# EAGLE schematic Laser_Teensy_AudShield (EAGLE 9.6.2)

## Sheet 1 of 3
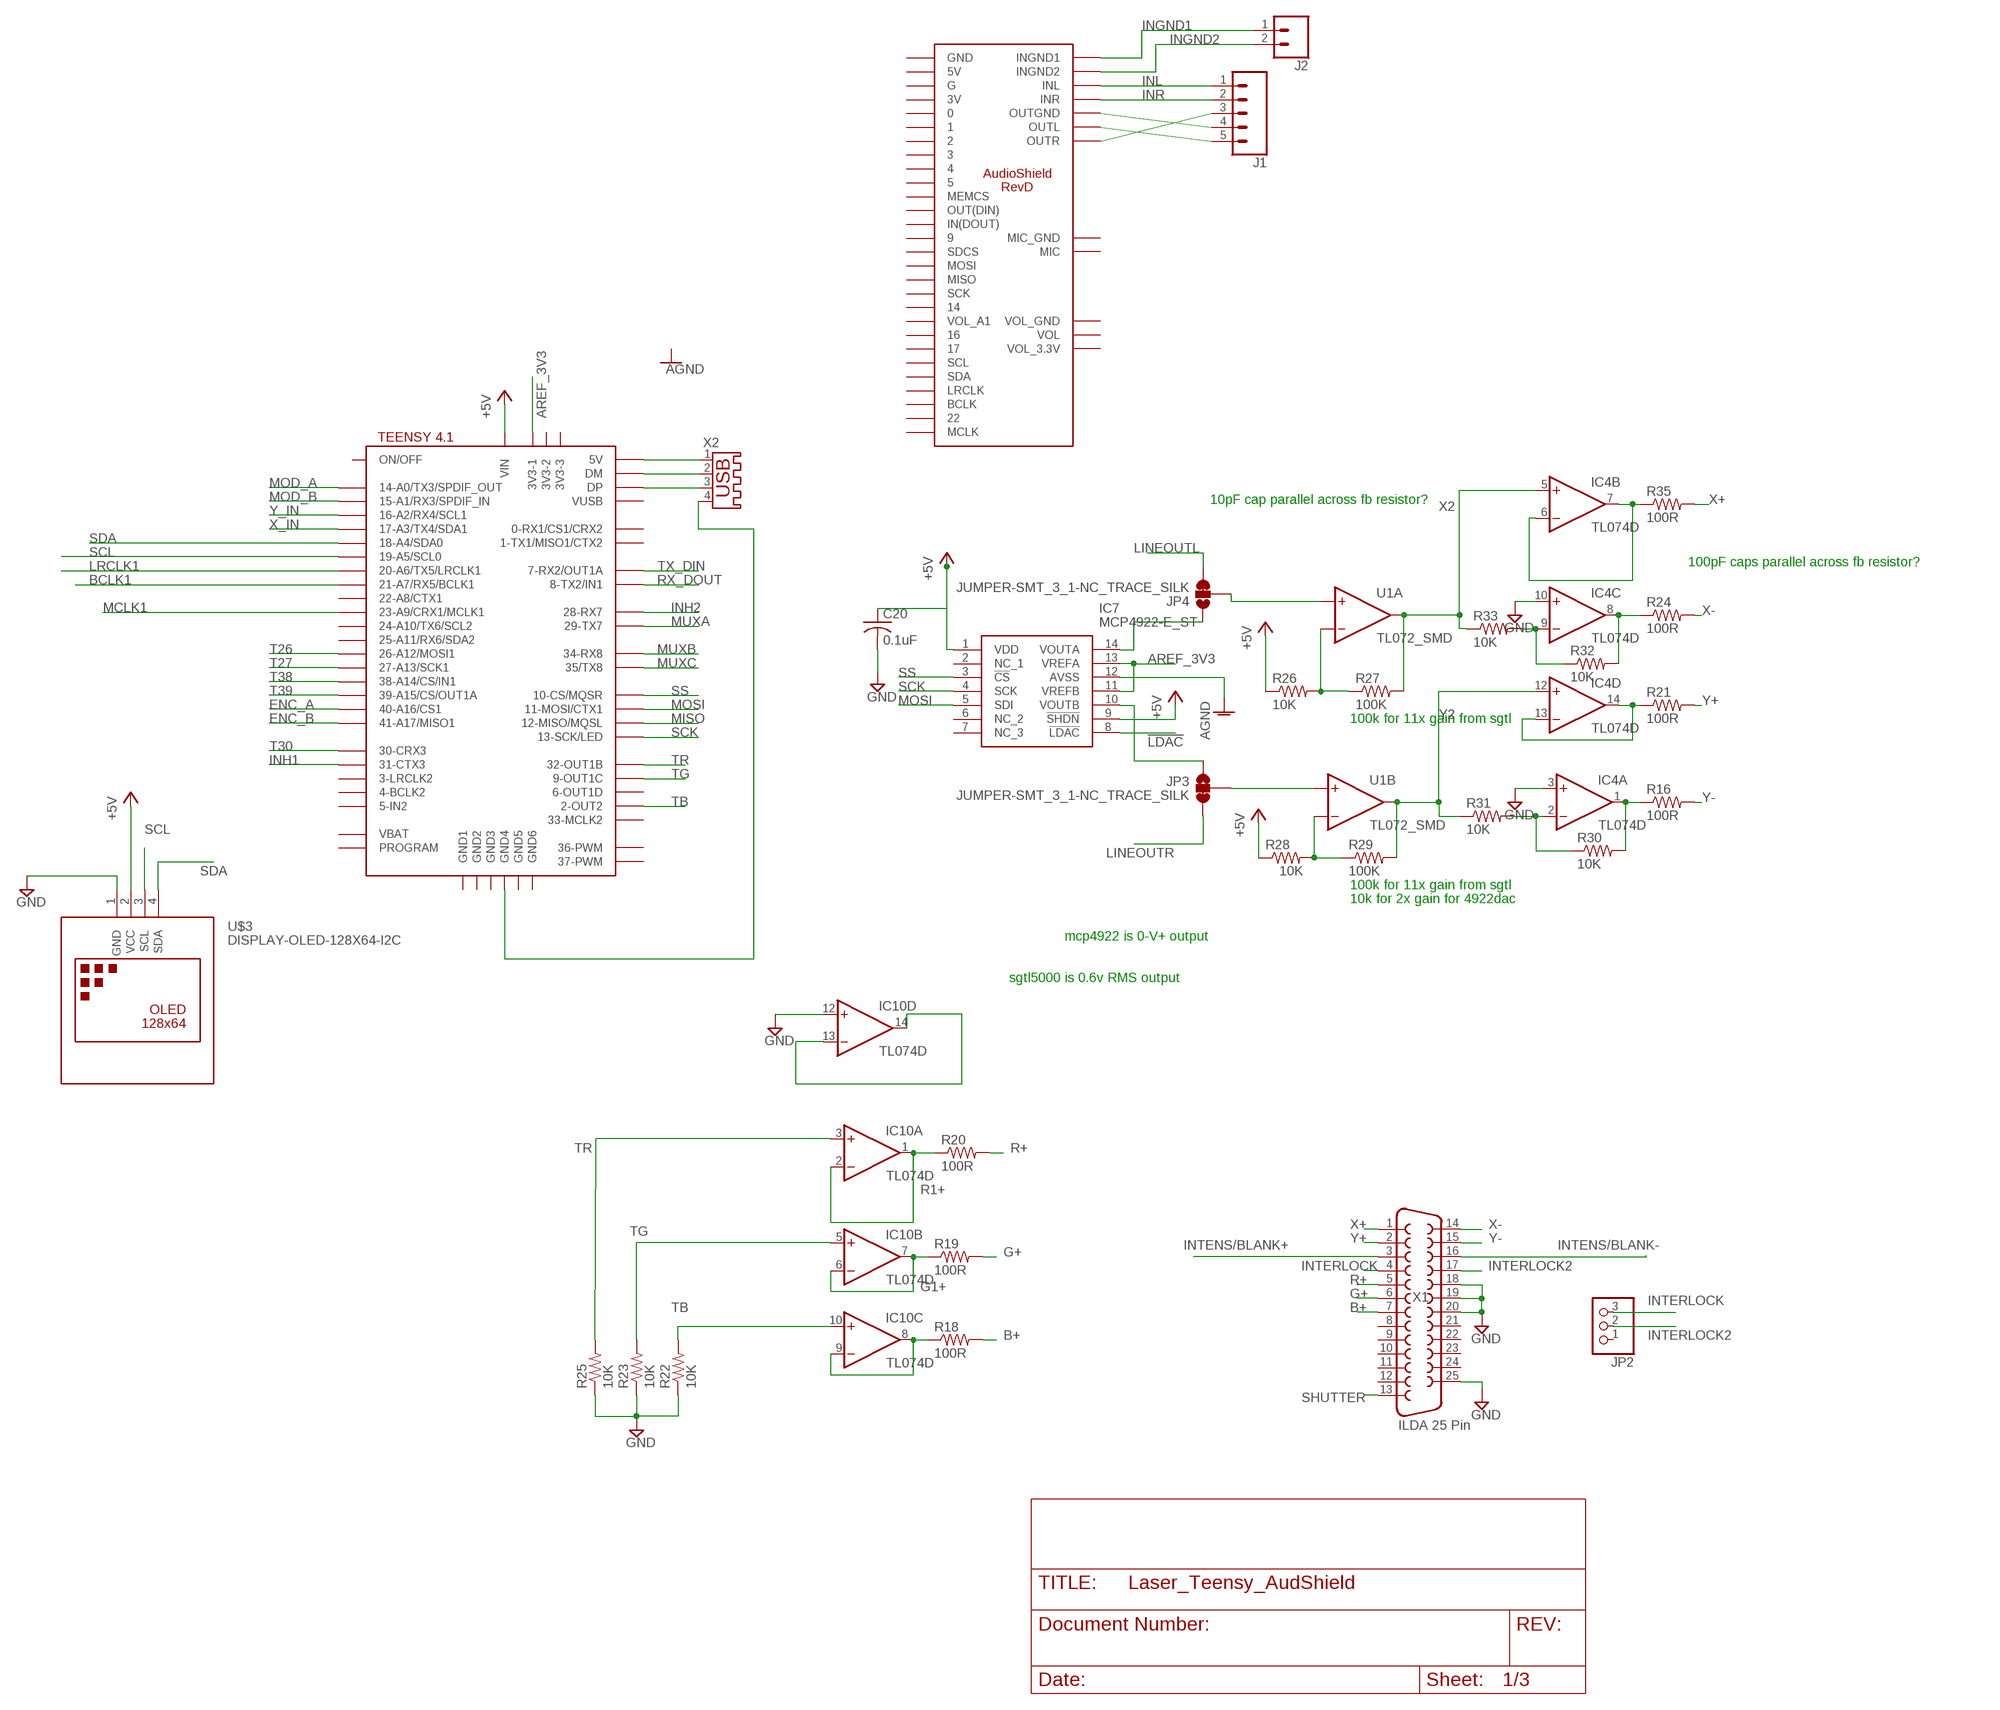
[diagram p0: schematic, sheet 1]

### Parts
C20  0.1uF  C-USC0603  [C0603]
IC4  TL074D  [SO14]
IC7  MCP4922-E_ST  [SOP65P638X110-14N]
IC10  TL074D  [SO14]
J1  CONN_05  [1X05]
J2  CONN_02  [1X02]
JP2  PINHD-1X3  [1X03]
JP3  JUMPER-SMT_3_1-NC_TRACE_SILK  [SMT-JUMPER_3_1-NC_TRACE_SILK]
JP4  JUMPER-SMT_3_1-NC_TRACE_SILK  [SMT-JUMPER_3_1-NC_TRACE_SILK]
R16  100R  R-US_R0603  [R0603]
R18  100R  R-US_R0603  [R0603]
R19  100R  R-US_R0603  [R0603]
R20  100R  R-US_R0603  [R0603]
R21  100R  R-US_R0603  [R0603]
R22  10K  R-US_R0603  [R0603]
R23  10K  R-US_R0603  [R0603]
R24  100R  R-US_R0603  [R0603]
R25  10K  R-US_R0603  [R0603]
R26  10K  R-US_R0603  [R0603]
R27  100K  R-US_R0603  [R0603]
R28  10K  R-US_R0603  [R0603]
R29  100K  R-US_R0603  [R0603]
R30  10K  R-US_R0603  [R0603]
R31  10K  R-US_R0603  [R0603]
R32  10K  R-US_R0603  [R0603]
R33  10K  R-US_R0603  [R0603]
R35  100R  R-US_R0603  [R0603]
U1  TL072_SMD  [SO08]
U$2  TEENSY41-E  [TENNSY41-E]
U$3  DISPLAY-OLED-128X64-I2C  [DISPLAY-OLED-128X64-I2C]
U$4  AUDIOSHIELD-REVD  [AUDIOSHIELD-REVD]
X1  ILDA 25 Pin  F25D  [F25D]
X2  USB-A003  [USB-A003]

### Nets
!LDAC: IC7.8(!LDAC)
+5V [power]: C20.1 IC7.1(VDD) IC7.9(!SHDN) R26.1 R28.1 U$2.VIN U$3.2(VCC) ; also sheet 3
AGND: IC7.12(AVSS)
AREF_3V3: IC7.11(VREFB) IC7.13(VREFA) U$2.3V3-1
B1+1: IC10.8(C:OUT) IC10.9(C:-IN) R18.1
B+: R18.2 X1.7
BCLK1: U$2.21-A7/RX5/BCLK1
ENC_A: U$2.40-A16/CS1 ; also sheet 2
ENC_B: U$2.41-A17/MISO1 ; also sheet 2
G1+: IC10.6(B:-IN) IC10.7(B:OUT) R19.1
G+: R19.2 X1.6
GND: C20.2 IC4.3(A:+IN) IC4.10(C:+IN) IC10.12(D:+IN) R22.1 R23.1 R25.1 U$3.1(GND) X1.18 X1.19 X1.20 X1.25 ; also sheet 2,3
INGND1: J2.1 U$4.INGND1
INGND2: J2.2 U$4.INGND2
INH1: U$2.31-CTX3 ; also sheet 2
INH2: U$2.28-RX7 ; also sheet 2
INL: J1.1 U$4.INL
INR: J1.2 U$4.INR
INTENS/BLANK+: X1.3
INTENS/BLANK-: X1.16
INTERLOCK: JP2.3 X1.4
INTERLOCK2: JP2.2 X1.17
LINEOUTL: JP4.3
LINEOUTR: JP3.3
LRCLK1: U$2.20-A6/TX5/LRCLK1
MCLK1: U$2.23-A9/CRX1/MCLK1
MISO: U$2.12-MISO/MQSL
MOD_A: U$2.14-A0/TX3/SPDIF_OUT ; also sheet 2
MOD_B: U$2.15-A1/RX3/SPDIF_IN ; also sheet 2
MOSI: IC7.5(SDI) U$2.11-MOSI/CTX1
MUXA: U$2.29-TX7 ; also sheet 2
MUXB: U$2.34-RX8 ; also sheet 2
MUXC: U$2.35-TX8(35/TX8) ; also sheet 2
N$1: IC7.14(VOUTA) JP4.1
N$2: IC7.10(VOUTB) JP3.1
N$3: U$2.+5V(5V) X2.1
N$4: U$2.DM X2.2
N$5: U$2.DP X2.3
N$12: U$2.GND4 X2.4
N$13: IC10.13(D:-IN) IC10.14(D:OUT)
N$17: JP3.2 U1.5(B:+IN)
N$18: JP4.2 U1.3(A:+IN)
N$20: J1.4 U$4.OUTGND
N$30: R26.2 R27.1 U1.2(A:-IN)
N$31: R28.2 R29.1 U1.6(B:-IN)
N$35: IC4.9(C:-IN) R32.1 R33.2
N$36: IC4.2(A:-IN) R30.1 R31.2
N$57: J1.3 U$4.OUTR
N$59: J1.5 U$4.OUTL
R1+: IC10.1(A:OUT) IC10.2(A:-IN) R20.1
R+: R20.2 X1.5
RX_DOUT: U$2.8-TX2/IN1
SCK: IC7.4(SCK) U$2.13-SCK/LED
SCL: U$2.19-A5/SCL0 U$3.3(SCL)
SDA: U$2.18-A4/SDA0 U$3.4(SDA)
SHUTTER: X1.13
SS: IC7.3(!CS) U$2.10-CS\MQSR(10-CS/MQSR)
T26: U$2.26-A12/MOSI1 ; also sheet 2
T27: U$2.27-A13/SCK1 ; also sheet 2
T30: U$2.30-CRX3
T38: U$2.38-A14/CS/IN1 ; also sheet 2
T39: U$2.39-A15/CS/OUT1A ; also sheet 2
TB: IC10.10(C:+IN) R22.2 U$2.2-OUT2
TG: IC10.5(B:+IN) R23.2 U$2.9-OUT1C
TR: IC10.3(A:+IN) R25.2 U$2.32-OUT1B
TX_DIN: U$2.7-RX2/OUT1A
X1+: IC4.6(B:-IN) IC4.7(B:OUT) R35.1
X1-: IC4.8(C:OUT) R24.1 R32.2
X2: IC4.5(B:+IN) R27.2 R33.1 U1.1(A:OUT)
X+: R35.2 X1.1
X-: R24.2 X1.14
X_IN: U$2.17-A3/TX4/SDA1 ; also sheet 2
Y1+: IC4.13(D:-IN) IC4.14(D:OUT) R21.1
Y1-: IC4.1(A:OUT) R16.1 R30.2
Y2: IC4.12(D:+IN) R29.2 R31.1 U1.7(B:OUT)
Y+: R21.2 X1.2
Y-: R16.2 X1.15
Y_IN: U$2.16-A2/RX4/SCL1 ; also sheet 2
Unconnected: IC7.2(NC_1) IC7.6(NC_2) IC7.7(NC_3) JP2.1 U$2.0-RX1/CS1/CRX2 U$2.1-TX1/MISO1/CTX2 U$2.3-LRCLK2 U$2.3V3-2 U$2.3V3-3 U$2.4-BCLK2 U$2.5-IN2 U$2.6-OUT1D U$2.22-A8/CTX1 U$2.24-A10/TX6/SCL2 U$2.25-A11/RX6/SDA2 U$2.33-MCLK2 U$2.36-PWM U$2.37-PWM U$2.GND1 U$2.GND2 U$2.GND3 U$2.GND5 U$2.GND6 U$2.ON/OFF U$2.PROGRAM U$2.VBAT U$2.VUSB U$4.0 U$4.1 U$4.2 U$4.3 U$4.3V U$4.4 U$4.5 U$4.5V U$4.6(MEMCS) U$4.7(OUT(DIN)) U$4.8(IN(DOUT)) U$4.9 U$4.10(SDCS) U$4.11(MOSI) U$4.12(MISO) U$4.13(SCK) U$4.14 U$4.15(VOL_A1) U$4.16 U$4.17 U$4.18(SDA) U$4.19(SCL) U$4.20(LRCLK) U$4.21(BCLK) U$4.22 U$4.23(MCLK) U$4.G U$4.GND U$4.GND_MIC(MIC_GND) U$4.MIC U$4.VOL U$4.VOL_3.3V U$4.VOL_GND X1.8 X1.9 X1.10 X1.11 X1.12 X1.21 X1.22 X1.23 X1.24

### Notes on the sheet
- 10pF cap parallel across fb resistor?
- 100pF caps parallel across fb resistor?
- 100k for 11x gain from sgtl
- 100k for 11x gain from sgtl
- 10k for 2x gain for 4922dac
- mcp4922 is 0-V+ output
- sgtl5000 is 0.6v RMS output

## Sheet 2 of 3
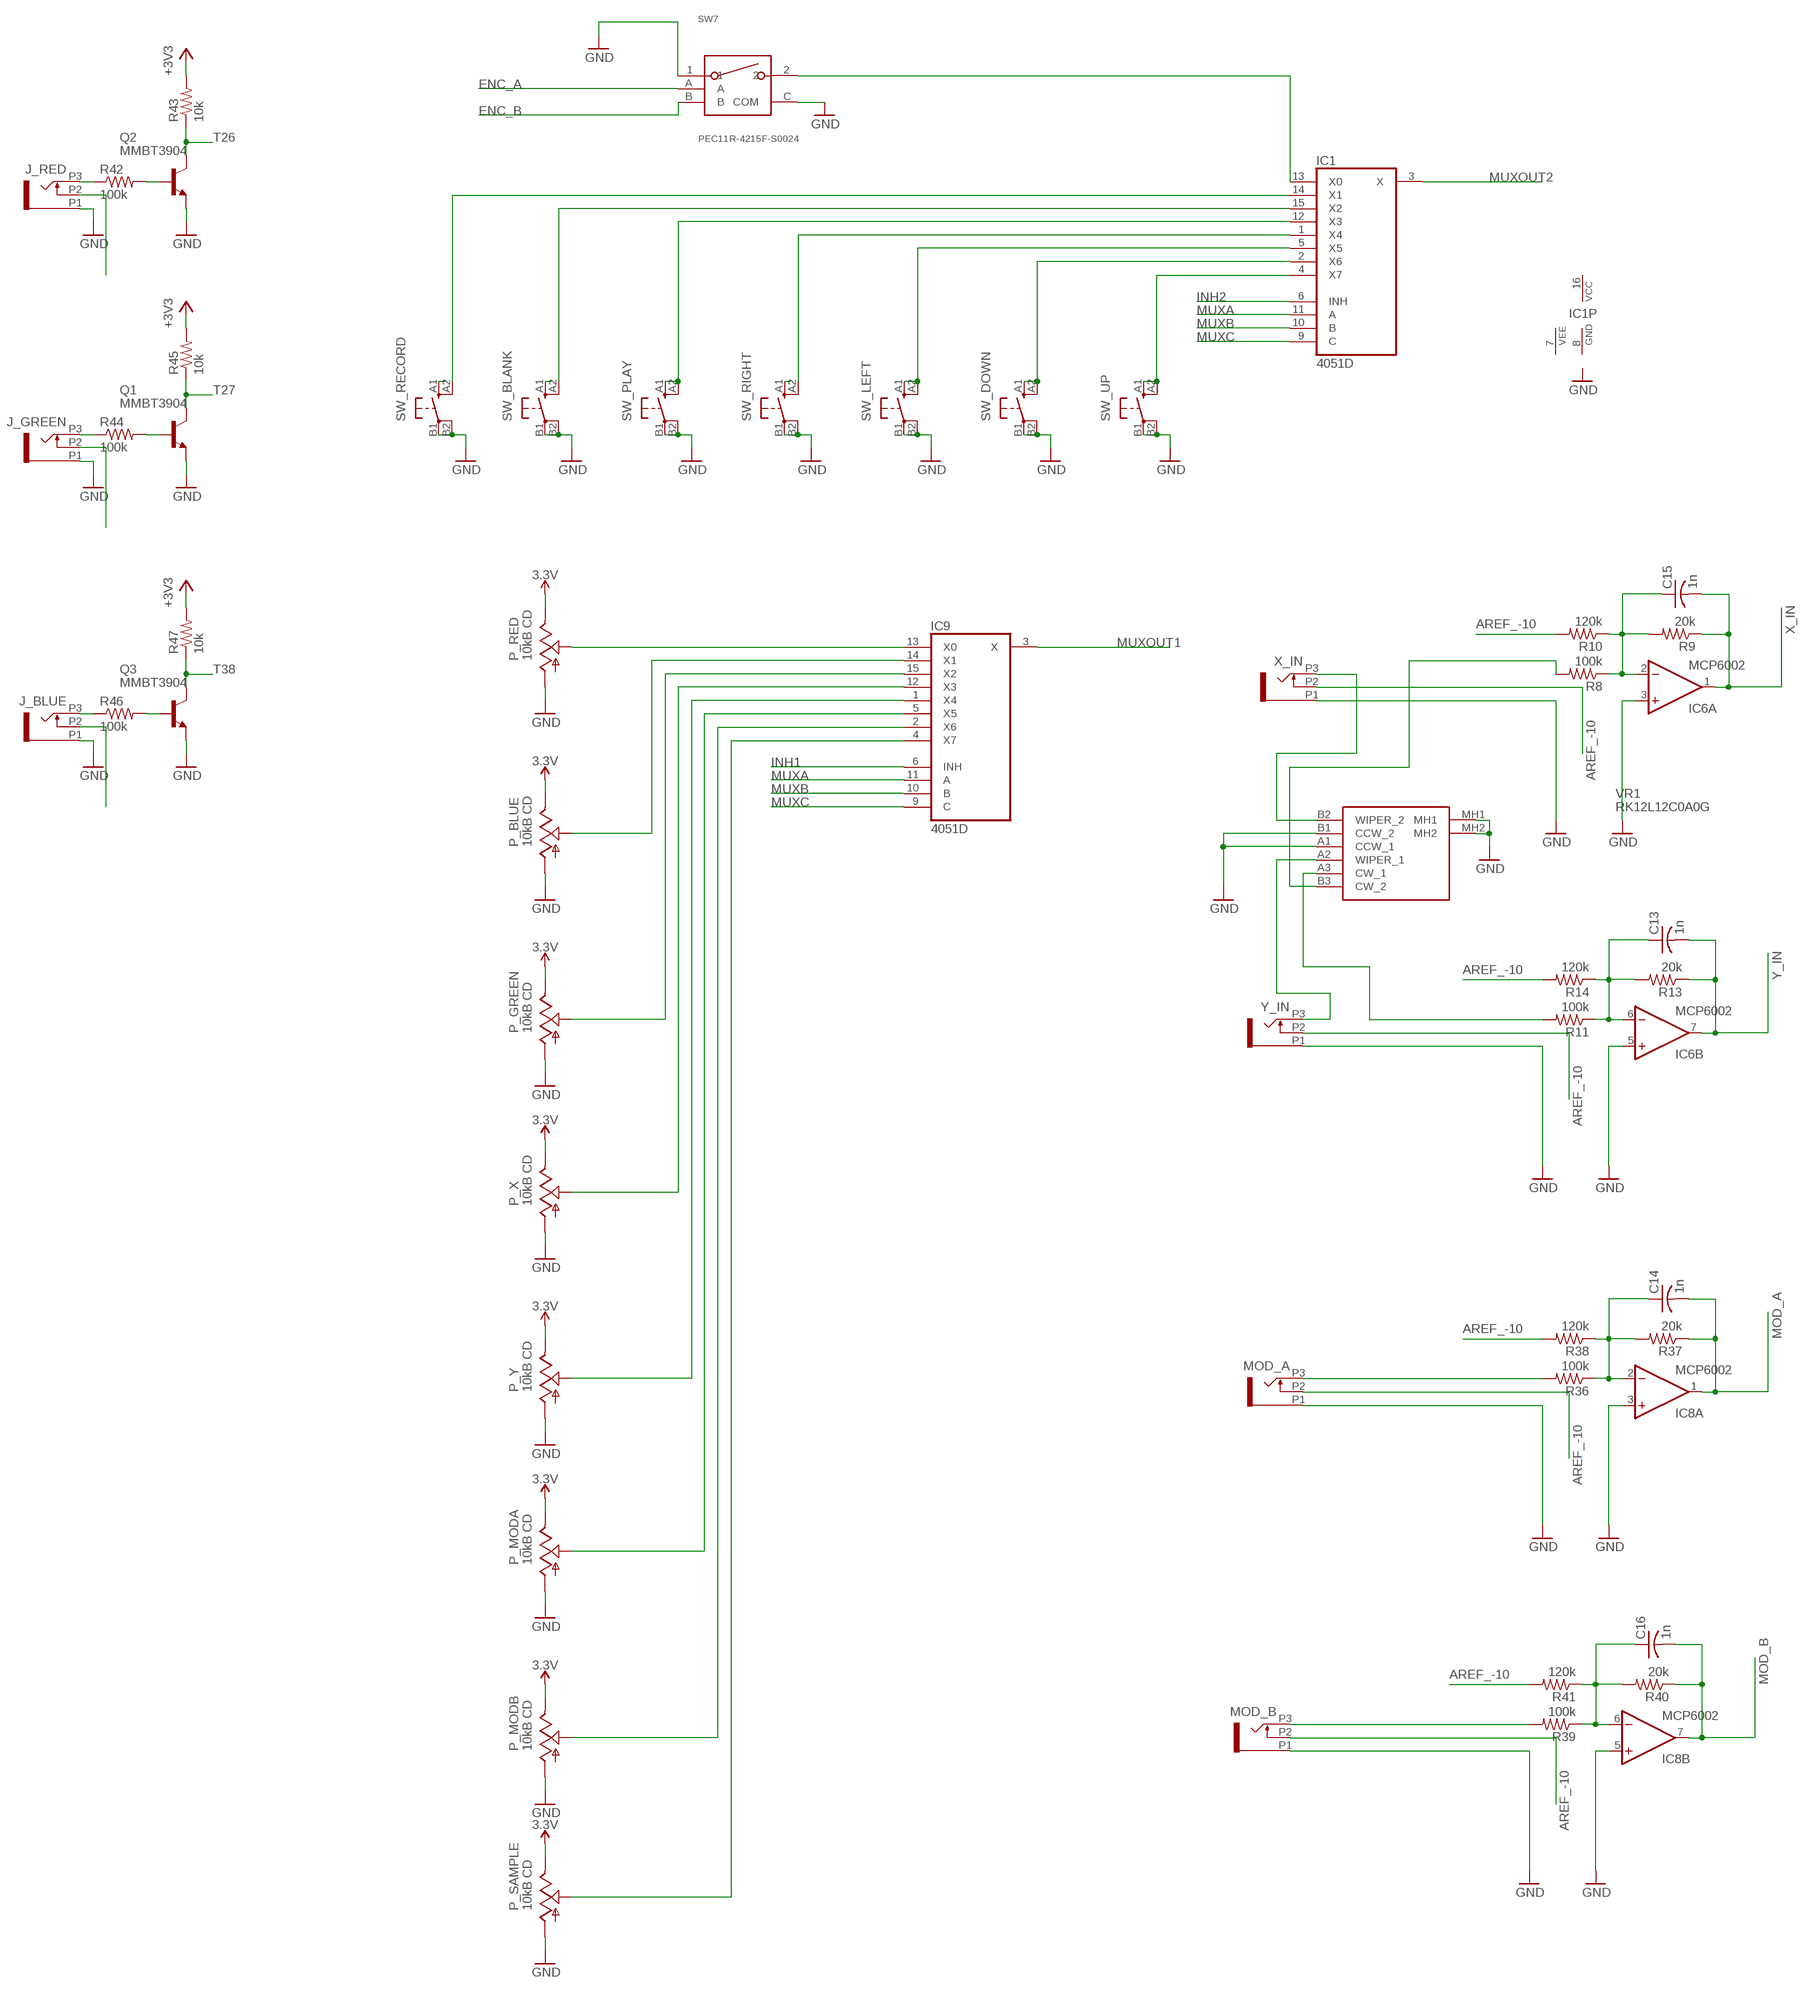
[diagram p1: schematic, sheet 2]

### Parts
C13  1n  C-US050-025X075  [C050-025X075]
C14  1n  C-US050-025X075  [C050-025X075]
C15  1n  C-US050-025X075  [C050-025X075]
C16  1n  C-US050-025X075  [C050-025X075]
IC1  4051D  [SO16]
IC6  MCP6002  TL072D  [SO08]
IC8  MCP6002  TL072D  [SO08]
IC9  4051D  [SO16]
J_BLUE  PJ301_THONKICONN6  [WQP_PJ_301M6]
J_GREEN  PJ301_THONKICONN6  [WQP_PJ_301M6]
J_RED  PJ301_THONKICONN6  [WQP_PJ_301M6]
MOD_A  PJ301_THONKICONN6  [WQP_PJ_301M6]
MOD_B  PJ301_THONKICONN6  [WQP_PJ_301M6]
P_BLUE  10kB CD  POT_USVERTICAL_PS  [ALPS_POT_VERTICAL_PS]
P_GREEN  10kB CD  POT_USVERTICAL_PS  [ALPS_POT_VERTICAL_PS]
P_MODA  10kB CD  POT_USVERTICAL_PS  [ALPS_POT_VERTICAL_PS]
P_MODB  10kB CD  POT_USVERTICAL_PS  [ALPS_POT_VERTICAL_PS]
P_RED  10kB CD  POT_USVERTICAL_PS  [ALPS_POT_VERTICAL_PS]
P_SAMPLE  10kB CD  POT_USVERTICAL_PS  [ALPS_POT_VERTICAL_PS]
P_X  10kB CD  POT_USVERTICAL_PS  [ALPS_POT_VERTICAL_PS]
P_Y  10kB CD  POT_USVERTICAL_PS  [ALPS_POT_VERTICAL_PS]
Q1  MMBT3904  MMBT3904LT1-NPN-SOT23-BEC  [SOT23-BEC]
Q2  MMBT3904  MMBT3904LT1-NPN-SOT23-BEC  [SOT23-BEC]
Q3  MMBT3904  MMBT3904LT1-NPN-SOT23-BEC  [SOT23-BEC]
R8  100k  R-US_0204/7  [0204/7]
R9  20k  R-US_0204/7  [0204/7]
R10  120k  R-US_0204/7  [0204/7]
R11  100k  R-US_0204/7  [0204/7]
R13  20k  R-US_0204/7  [0204/7]
R14  120k  R-US_0204/7  [0204/7]
R36  100k  R-US_0204/7  [0204/7]
R37  20k  R-US_0204/7  [0204/7]
R38  120k  R-US_0204/7  [0204/7]
R39  100k  R-US_0204/7  [0204/7]
R40  20k  R-US_0204/7  [0204/7]
R41  120k  R-US_0204/7  [0204/7]
R42  100k  R-US_R0603  [R0603]
R43  10k  R-US_R0603  [R0603]
R44  100k  R-US_R0603  [R0603]
R45  10k  R-US_R0603  [R0603]
R46  100k  R-US_R0603  [R0603]
R47  10k  R-US_R0603  [R0603]
SW7  PEC11R-4215F-S0024  [PEC11R-4215F-S0024]
SW_BLANK  D6R  [D6R]
SW_DOWN  D6R  [D6R]
SW_LEFT  D6R  [D6R]
SW_PLAY  D6R  [D6R]
SW_RECORD  D6R  [D6R]
SW_RIGHT  D6R  [D6R]
SW_UP  D6R  [D6R]
VR1  RK12L12C0A0G  [RK12L12C0A0G]
X_IN  PJ301_THONKICONN6  [WQP_PJ_301M6]
Y_IN  PJ301_THONKICONN6  [WQP_PJ_301M6]

### Nets
3.3V [+3V3]: P_BLUE.P$1(E) P_GREEN.P$1(E) P_MODA.P$1(E) P_MODB.P$1(E) P_RED.P$1(E) P_SAMPLE.P$1(E) P_X.P$1(E) P_Y.P$1(E)
+3V3: R43.2 R45.2 R47.2 ; also sheet 3
AREF_-10 [-10V]: MOD_A.P2 MOD_B.P2 R10.2 R14.2 R38.2 R41.2 X_IN.P2 Y_IN.P2 ; also sheet 3
ENC_A: SW7.A ; also sheet 1
ENC_B: SW7.B ; also sheet 1
GND: IC6.3(A:+IN) IC6.5(B:+IN) IC8.3(A:+IN) IC8.5(B:+IN) J_BLUE.P1 J_GREEN.P1 J_RED.P1 MOD_A.P1 MOD_B.P1 P_BLUE.P$3(A) P_GREEN.P$3(A) P_MODA.P$3(A) P_MODB.P$3(A) P_RED.P$3(A) P_SAMPLE.P$3(A) P_X.P$3(A) P_Y.P$3(A) Q1.E Q2.E Q3.E SW7.1 SW7.C(COM) SW_BLANK.B2(P1) SW_DOWN.B1(P) SW_DOWN.B2(P1) SW_LEFT.B1(P) SW_LEFT.B2(P1) SW_PLAY.B1(P) SW_PLAY.B2(P1) SW_RECORD.B2(P1) SW_RIGHT.B2(P1) SW_UP.B1(P) SW_UP.B2(P1) VR1.A1(CCW_1) VR1.B1(CCW_2) VR1.MH1 VR1.MH2 X_IN.P1 Y_IN.P1 ; also sheet 1,3
INH1: IC9.6(INH) ; also sheet 1
INH2: IC1.6(INH) ; also sheet 1
MOD_A: C14.2 IC8.1(A:OUT) R37.1 ; also sheet 1
MOD_B: C16.2 IC8.7(B:OUT) R40.1 ; also sheet 1
MUXA: IC1.11(A) IC9.11(A) ; also sheet 1
MUXB: IC1.10(B) IC9.10(B) ; also sheet 1
MUXC: IC1.9(C) IC9.9(C) ; also sheet 1
MUXOUT1: IC9.3(X)
MUXOUT2: IC1.3(X)
N$6: C15.1 IC6.2(A:-IN) R8.1 R9.2 R10.1
N$9: VR1.B2(WIPER_2) X_IN.P3
N$11: C13.1 IC6.6(B:-IN) R11.1 R13.2 R14.1
N$14: C14.1 IC8.2(A:-IN) R36.1 R37.2 R38.1
N$15: R8.2 VR1.B3(CW_2)
N$19: SW_BLANK.A1(S)
N$21: SW_BLANK.B1(P)
N$22: IC9.13(X0) P_RED.P$2(S)
N$23: SW_RIGHT.B1(P)
N$24: IC9.14(X1) P_BLUE.P$2(S)
N$25: VR1.A2(WIPER_1) Y_IN.P3
N$26: IC1.1(X4) SW_RIGHT.A2(S1)
N$27: IC9.15(X2) P_GREEN.P$2(S)
N$28: IC1.15(X2) SW_BLANK.A2(S1)
N$29: IC9.12(X3) P_X.P$2(S)
N$32: IC9.1(X4) P_Y.P$2(S)
N$33: SW_RECORD.B1(P)
N$34: C16.1 IC8.6(B:-IN) R39.1 R40.2 R41.1
N$37: SW_RECORD.A1(S)
N$38: IC1.14(X1) SW_RECORD.A2(S1)
N$39: IC1.13(X0) SW7.2
N$40: IC9.5(X5) P_MODA.P$2(S)
N$41: IC9.2(X6) P_MODB.P$2(S)
N$42: IC9.4(X7) P_SAMPLE.P$2(S)
N$43: R11.2 VR1.A3(CW_1)
N$44: J_RED.P3 R42.1
N$45: MOD_A.P3 R36.2
N$46: MOD_B.P3 R39.2
N$47: J_RED.P2
N$48: Q1.B R44.2
N$49: J_GREEN.P3 R44.1
N$50: J_GREEN.P2
N$51: Q3.B R46.2
N$52: J_BLUE.P3 R46.1
N$53: J_BLUE.P2
N$66: Q2.B R42.2
T26: Q2.C R43.1 ; also sheet 1
T27: Q1.C R45.1 ; also sheet 1
T38: IC1.2(X6) IC1.12(X3) Q3.C R47.1 SW_DOWN.A1(S) SW_DOWN.A2(S1) SW_PLAY.A1(S) SW_PLAY.A2(S1) ; also sheet 1
T39: IC1.4(X7) IC1.5(X5) SW_LEFT.A1(S) SW_LEFT.A2(S1) SW_RIGHT.A1(S) SW_UP.A1(S) SW_UP.A2(S1) ; also sheet 1
X_IN: C15.2 IC6.1(A:OUT) R9.1 ; also sheet 1
Y_IN: C13.2 IC6.7(B:OUT) R13.1 ; also sheet 1

## Sheet 3 of 3
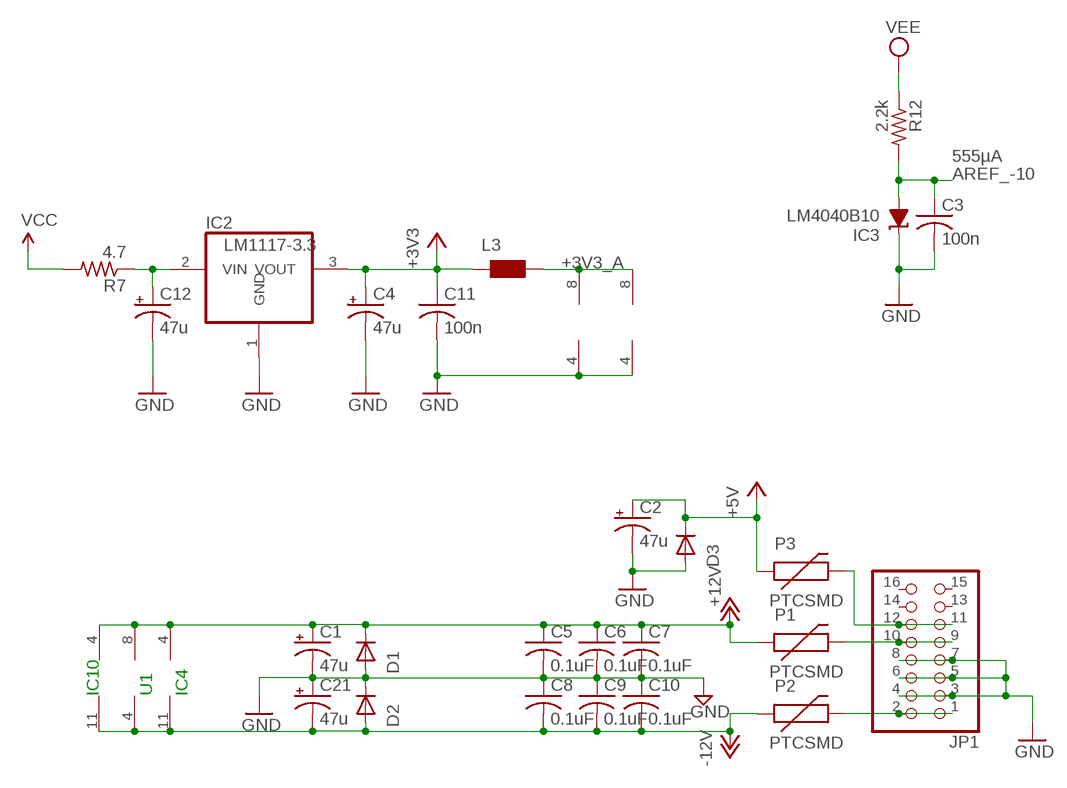
[diagram p2: schematic, sheet 3]

### Parts
C1  47u  CPOL-USD  [PANASONIC_D]
C2  47u  CPOL-USD  [PANASONIC_D]
C3  100n  C-USC0603  [C0603]
C4  47u  CPOL-USD  [PANASONIC_D]
C5  0.1uF  C-USC0603  [C0603]
C6  0.1uF  C-USC0603  [C0603]
C7  0.1uF  C-USC0603  [C0603]
C8  0.1uF  C-USC0603  [C0603]
C9  0.1uF  C-USC0603  [C0603]
C10  0.1uF  C-USC0603  [C0603]
C11  100n  C-USC0603  [C0603]
C12  47u  CPOL-USD  [PANASONIC_D]
C21  47u  CPOL-USD  [PANASONIC_D]
D1  1N5819HW  DIODE-SOD123  [SOD123]
D2  1N5819HW  DIODE-SOD123  [SOD123]
D3  1N5819HW  DIODE-SOD123  [SOD123]
IC2  LM1117-3.3  REG1117T  [TO252]
IC3  LM4040B10  LM4041B12DBZ  [DBZ_R-PDSO-G3]
JP1  PINHD-2X8  [2X08]
L3  WE-CBF_0603  [0603]
P1  PTCSMD  [PTC-1206]
P2  PTCSMD  [PTC-1206]
P3  PTCSMD  [PTC-1206]
R7  4.7  R-US_R1206  [R1206]
R12  2.2k  R-US_R0603  [R0603]

### Nets
+3V3: C4.+ C11.1 IC2.3(VOUT) L3.1 ; also sheet 2
+3V3_A: IC6.8(P:V+) IC8.8(P:V+) L3.2
+5V [power]: C2.+ D3.C P3.1 ; also sheet 1
+12V [power]: C1.+ C5.1 C6.1 C7.1 D1.C IC4.4(P:V+) IC10.4(P:V+) P1.1 U1.8(P:V+)
-12V [power]: C8.2 C9.2 C10.2 C21.- D2.A IC4.11(P:V-) IC10.11(P:V-) P2.1 U1.4(P:V-)
AREF_-10 [-10V]: C3.1 IC3.2(A) R12.2 ; also sheet 2
GND: C1.- C2.- C3.2 C4.- C5.2 C6.2 C7.2 C8.1 C9.1 C10.1 C11.2 C12.- C21.+ D1.A D2.C D3.A IC2.1(GND) IC3.1(C) IC6.4(P:V-) IC8.4(P:V-) JP1.3 JP1.4 JP1.5 JP1.6 JP1.7 JP1.8 ; also sheet 1,2
N$7: JP1.1 JP1.2 P2.2
N$8: JP1.9 JP1.10 P1.2
N$10: JP1.11 JP1.12 P3.2
N$16: C12.+ IC2.2(VIN) R7.1
VCC [VCC]: R7.2
VEE: R12.1
Unconnected: JP1.13 JP1.14 JP1.15 JP1.16

### Notes on the sheet
- 555µA
- IC10 | U1 | IC4

## Power pins joined to a net without a drawn wire
GND: IC1.8(GND) IC9.8(GND)
VCC: IC1.16(VCC) IC9.16(VCC)
VEE: IC1.7(VEE) IC9.7(VEE)

## Library data of the parts
C1 C2 C4 C12 C21 = rcl:CPOL-US: POLARIZED CAPACITOR, American symbol
C3 C11 = rcl:C-US: CAPACITOR, American symbol
C5-C10 C20 = adafruit:C-US: CAPACITOR, American symbol
C13-C16 = rcl:C-US: CAPACITOR, American symbol; SPICEPREFIX: C
D1-D3 = diode:DIODE-: DIODE
IC1 IC9 = 40xx:4051: 8-channel ANALOG MULTIPLEXER
IC2 = og-vreg:REG1117: 800mA and 1A Low Dropout (LDO) Positive Regulator 1.8V, 2.5V, 2.85V, 3.3V, 5V, and Adj
IC3 = texas:LM4041: PRECISION MICROPOWER SHUNT VOLTAGE REFERENCE Source: http://focus.ti.com/lit/ds/slcs146e/slcs146e.pdf
IC4 IC10 = linear:TL074: OP AMP
IC6 IC8 = linear:TL072: OP AMP
IC7 = SamacSys_Parts:MCP4922-E_ST: Microchip MCP4922-E/ST, 2-channel 12 bit Serial DAC, 14-Pin TSSOP Source: Datasheet <http://componentsearchengine.com/Datasheets/3/MCP4922-E_ST.pdf>; ARROW_PART_NUMBER: MCP4922-E/ST; ARROW_PRICE-STOCK: https://www.arrow.com/en/products/mcp4922-est/microchip-technology; DESCRIPTION: Microchip MCP4922-E/ST, 2-channel 12 bit Serial DAC, 14-Pin TSSOP; HEIGHT: 1.1mm; MANUFACTURER_NAME: Microchip; MANUFACTURER_PART_NUMBER: MCP4922-E/ST; MOUSER_PART_NUMBER: 579-MCP4922-E/ST; MOUSER_PRICE-STOCK: https://www.mouser.co.uk/ProductDetail/Microchip-Technology/MCP4922-E-ST?qs=iRhCjdSJZe6gRerFwLixKQ%3D%3D
J1 = SparkFun-Connectors:CONN_05: Multi connection point. Often used as Generic Header-pin footprint for 0.1 inch spaced/style header connections On any of the 0.1 inch spaced packages, you can populate with these: Break Away Headers - Straight <https://www.sparkfun.com/products/116> (PRT-00116) Break Away Male Headers - Right Angle <https://www.sparkfun.com/products/553> (PRT-00553) Female Headers <https://www.sparkfun.com/products/115> (PRT-00115) Break Away Headers - Machine Pin <https://www.sparkfun.com/products/117> (PRT-00117) Break Away Female Headers - Swiss Machine Pin <https://www.sparkfun.com/products/743> (PRT-00743) For SCREWTERMINALS and SPRING TERMINALS visit here: Screw Terimnals on SparkFun.com <https://www.sparkfun.com/search/results?term=Screw+Terminals> (5mm/3.5mm/2.54mm spacing) This device is also useful as a general connection point to wire up your design to another part of your project. Our various solder wires solder well into these plated through hole pads. Hook-Up Wire - Assortment (Stranded, 22 AWG) <https://www.sparkfun.com/products/11375> (PRT-11375) Hook-Up Wire - Assortment (Solid Core, 22 AWG) <https://www.sparkfun.com/products/11367> (PRT-11367) View the entire wire category on our website here <https://www.sparkfun.com/categories/141> Special notes: Molex polarized connector foot print use with SKU : PRT-08231 with associated crimp pins and housings. 1MM SMD Version SKU: PRT-10208
J2 = SparkFun-Connectors:CONN_02: Multi connection point. Often used as Generic Header-pin footprint for 0.1 inch spaced/style header connections On any of the 0.1 inch spaced packages, you can populate with these: Break Away Headers - Straight <https://www.sparkfun.com/products/116> (PRT-00116) Break Away Male Headers - Right Angle <https://www.sparkfun.com/products/553> (PRT-00553) Female Headers <https://www.sparkfun.com/products/115> (PRT-00115) Break Away Headers - Machine Pin <https://www.sparkfun.com/products/117> (PRT-00117) Break Away Female Headers - Swiss Machine Pin <https://www.sparkfun.com/products/743> (PRT-00743) For SCREWTERMINALS and SPRING TERMINALS visit here: Screw Terimnals on SparkFun.com <https://www.sparkfun.com/search/results?term=Screw+Terminals> (5mm/3.5mm/2.54mm spacing) This device is also useful as a general connection point to wire up your design to another part of your project. Our various solder wires solder well into these plated through hole pads. Hook-Up Wire - Assortment (Stranded, 22 AWG) <https://www.sparkfun.com/products/11375> (PRT-11375) Hook-Up Wire - Assortment (Solid Core, 22 AWG) <https://www.sparkfun.com/products/11367> (PRT-11367) View the entire wire category on our website here <https://www.sparkfun.com/categories/141> Special notes: Molex polarized connector foot print use with: PRT-08233 with associated crimp pins and housings. 2.54_SCREWTERM for use with PRT-10571. 3.5mm Screw Terminal footprints for PRT-08084 5mm Screw Terminal footprints for use with PRT-08432
J_BLUE J_GREEN J_RED = og-pj301:PJ301_THONKICONN
JP1 = pinhead:PINHD-2X8: PIN HEADER
JP2 = pinhead:PINHD-1X3: PIN HEADER
JP3 JP4 = SparkFun-Jumpers:JUMPER-SMT_3_1-NC_TRACE: Normally closed trace jumper (1 of 2 connections) This jumper has a trace between two pads so it's normally closed (NC). The other connection is normally open (NO). Use a razor knife to open the connection. For best results follow the IPC guidelines for cutting traces: Cutout at least 0.063 mm (0.005 in). Remove all loose material to clean up the cut area. Seal the cut with an approved epoxy. Reapply solder to reclose the connection, or to close the NO connection.
L3 = wuerth-elektronik:WE-CBF: SMD EMI Suppression Ferrite Beads - excellent anti-EMI properties - low DCR - impedances till 3000 ohms - rated current up to 6 A
MOD_A MOD_B X_IN Y_IN = og-pj301_variations:PJ301_THONKICONN
P1-P3 = SparkFun:PTC: Resettable Fuse PTC Resettable Fuse. Spark Fun Electronics SKU : COM-08357
P_BLUE P_GREEN P_MODA P_MODB P_RED P_SAMPLE P_X P_Y = pot-alps:POT_US
Q1-Q3 = transistor:*-NPN-: NPN Transistror BF959 corrected 2008.03.06
R7 R12 R42-R47 = rcl:R-US_: RESISTOR, American symbol
R8-R11 R13 R14 R36-R41 = rcl:R-US_: RESISTOR, American symbol; SPICEPREFIX: R
R16 R18-R33 R35 = resistor:R-US_: RESISTOR, American symbol
SW7 = Switch:PEC11R-4215F-S0024: ROTARY ENCODER MECHANICAL 24PPR Manufacturer's datasheet <https://www.bourns.com/docs/Product-Datasheets/PEC11R.pdf>; CREATED_BY: PCBLayout.com; DIGIKEY_PART_NUMBER: PEC11R-4215F-S0024-ND; MANUFACTURER: Bourns Inc.; MPN: PEC11R-4215F-S0024
SW_BLANK SW_DOWN SW_LEFT SW_PLAY SW_RECORD SW_RIGHT SW_UP = og-switch:D6R: C&K D6R
U1 = MusicThingModular:TL072: Generic Dual Op Amp
U$2 = teensy:TEENSY41-E
U$3 = diy-modules:DISPLAY-OLED-128X64-I2C: 128x64 Dot Matrix OLED Module based on SSD1306 chip Variant with I2C interface More details available here: http://www.instructables.com/id/Monochrome-096-i2c-OLED-display-with-arduino-SSD13/ SSD1306 datasheet: https://cdn-shop.adafruit.com/datasheets/SSD1306.pdf Click here to find device on ebay.com <http://www.ebay.com/sch/oled+display+128x64+iic> Note: There are two variants: I2C and SPI. Search for the proper version.
U$4 = Teensy_Audioshield:AUDIOSHIELD-REVD
VR1 = SamacSys_Parts:RK12L12C0A0G: Alps Potentiometer RK12L Series with a 6 mm Dia. Shaft 10k +/-20%, Logarithmic, Through Hole Source: Datasheet <http://uk.rs-online.com/web/p/products/7293697P>; DESCRIPTION: Alps Potentiometer RK12L Series with a 6 mm Dia. Shaft 10k +/-20%, Logarithmic, Through Hole; HEIGHT: 15mm; MANUFACTURER_NAME: ALPS; MANUFACTURER_PART_NUMBER: RK12L12C0A0G; MOUSER_PART_NUMBER: 688-RK12L12C0A0G; MOUSER_PRICE-STOCK: https://www.mouser.co.uk/ProductDetail/ALPS/RK12L12C0A0G?qs=haWY0xvQGj%2FMhz6JhOHy%252BQ%3D%3D
X1 = SparkFun:F25: D-SUB 25 25 Pin male connector. PCB edge mount for regular PCB thicknesses. This connector will connect directly to the back of a PC parallel port or through a normal DB25 extension cable (M/F). SKU: PRT-08287
X2 = con-yamaichi:USB-A003: USB connector; OC_FARNELL: unknown; OC_NEWARK: unknown

## Net classes
1 power: width 0.305 mm, clearance 0.203 mm
2 +3V3: width 0.356 mm, clearance 0.152 mm to class 0, clearance 0.254 mm
3 -10V: width 0.356 mm, clearance 0.152 mm to class 0, clearance 0.254 mm
4 VCC: width 0.457 mm, clearance 0.152 mm to class 0, clearance 0.254 mm